# Altium schematic sheet LED.SchDoc
size A
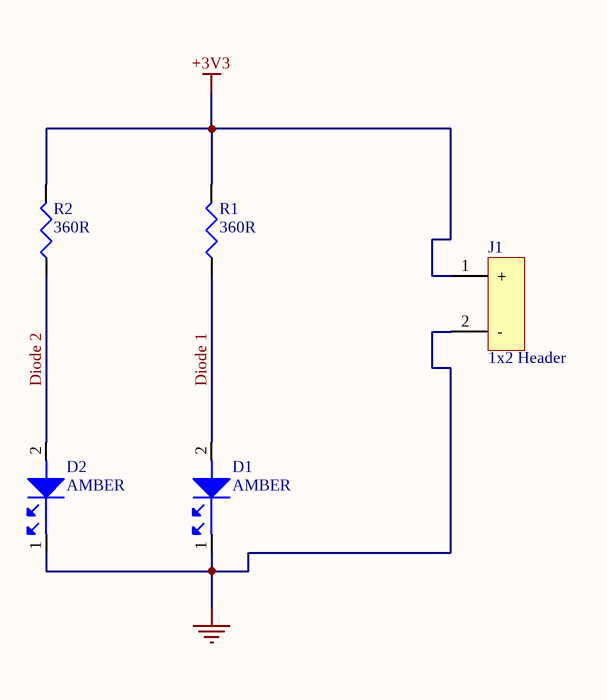
[diagram p0: LED.SchDoc]

## Parts
D1  AMBER  [LED0603A]
D2  AMBER  [LED0603A]
J1  1x2 Header  [HDR1x2]
R1  360R  [R0805]
R2  360R  [R0805]

## Nets
+3V3: J1.1(+) R1.2 R2.2
Ground: D1.1 D2.1 J1.2(-)
Diode 1: D1.2 R1.1
Diode 2: D2.2 R2.1

## Library data of the parts
D1 D2 = LNJ437W84RA: LED AMBER ESS II SMD; Manufacturer: Panasonic SSG; Color: Orange; Wavelength: 590nm; Forward Voltage: 1.95V; Luminous Intensity: 25mcd; Forward Current: 5mA; Lens Style: Rectangular; Number of LEDs: 1; Max Power Dissipation: 55mW; Reverse Voltage: 4V; Supplier 1: Digi-Key; Supplier Part Number 1: LNJ437W84RADKR-ND; Manufacturer Part Number: LNJ437W84RA; Stock 1: 200969; Pricing 1: 1=0.32, 10=0.212, 100=0.1521, 500=0.12762, 1000=0.11988 (USD); Mount: Surface Mount; Case/Package: 0603; Number of Pins: 2; Case Code (Metric): 1608; Case Code (Imperial): 0603; Min Operating Temperature: -30°C; Max Operating Temperature: 85°C; Package Quantity: 5000; Packaging: Tape and Reel; Illumination Color: Orange; Test Current: 5mA; Dominant Wavelength: 590nm; Length: 1.6mm; Height: 0.2mm; Width: 0.8mm; REACH SVHC: No SVHC; Lead Free: Lead Free; ComponentLink1URL: http://www.mouser.com/ds/2/315/LNJ437W84RA_AEK-226228.pdf?src-supplier=Mouser; ComponentLink1Description: http://www.mouser.com/ds/2/315/LNJ437W84RA_AEK-226228.pdf?src-supplier=Mouser; ComponentLink2URL: http://www.semicon.panasonic.co.jp/ds4/LNJ437W84RA_AEK.pdf?src-supplier=Element14; ComponentLink2Description: http://www.semicon.panasonic.co.jp/ds4/LNJ437W84RA_AEK.pdf?src-supplier=Element14; Category: Optoelectronics
J1 = 22-29-2021 (2): Headers & Wire Housings 2 PIN F/LK HEADER; Manufacturer: Molex; Number of Positions: 2; Connector Type: Header,Male Pin; Gender: Male; Voltage Rating (DC): 250V; Contact Post Length: 0.14inch; Glow Wire Compliant: Non-compliant; Supplier 1: Digi-Key; Manufacturer Part Number: 22-29-2021; Stock 1: 2431; Pricing 1: 1=0.48, 10=0.452, 100=0.3163, 500=0.27112, 1000=0.22593, 5000=0.19365, 10000=0.18074 (USD); Mount: Through Hole; Color: White; Contact Plating: Gold; Contact Material: Brass; Contact Shape: Square; Insulation Material: Nylon; Insulation Color: Natural; Max Operating Temperature: 80°C; Number of Rows: 1; Packaging: Bag; Termination: Solder; Fastening Type: Friction; Contact Mating Length: 0.295inch; Insulation Height: 0.461inch; Lead Free: Lead Free; Halogen Free: Low Halogen; Flammability Rating: UL94 V-0; ComponentLink1URL: https://www.molex.com/pdm_docs/sd/022292021_sd.pdf?src-supplier=Digi-Key; ComponentLink1Description: https://www.molex.com/pdm_docs/sd/022292021_sd.pdf?src-supplier=Digi-Key; Supplier Part Number 1: WM2744-ND; Category: Connectors
R1 R2 = CRCW0805360RFKEA: RES SMD 360 OHM 1% 1/8W 0805; Manufacturer: Vishay; Temperature Coefficient: 100ppm/°C; Max Power Dissipation: 125mW; Voltage Rating (DC): 150V; Supplier 1: Digi-Key; Supplier Part Number 1: 541-360CDKR-ND; Manufacturer Part Number: CRCW0805360RFKEA; Stock 1: 18934; Pricing 1: 1=0.1, 10=0.066, 100=0.0267, 1000=0.01199, 2500=0.01041 (USD); Case/Package: 0805; Number of Pins: 2; Weight: 0.000194oz; Case Code (Metric): 2012; Case Code (Imperial): 0805; Contact Plating: Tin; Number of Terminals: 2; Min Operating Temperature: -55°C; Max Operating Temperature: 155°C; Resistance: 360R; Tolerance: 1%; Packaging: Tape and Reel; Composition: Thick Film; Package Quantity: 10; Number of Terminations: 2; Features: Automotive AEC-Q200; Power Rating: 125mW; Voltage Rating: 150V; Termination: SMD/SMT; Military Standard: Not; Length: 2mm; Height: 0.45mm; Width: 0.049inch; Depth: 1.25mm; Radiation Hardening: No; Lead Free: Lead Free; REACH SVHC: Unknown; ComponentLink1URL: http://www.vishay.com/docs/20035/dcrcwe3.pdf?src-supplier=Digi-Key; ComponentLink1Description: http://www.vishay.com/docs/20035/dcrcwe3.pdf?src-supplier=Digi-Key; Category: Resistors